# Altium project Esp32.PrjPcb
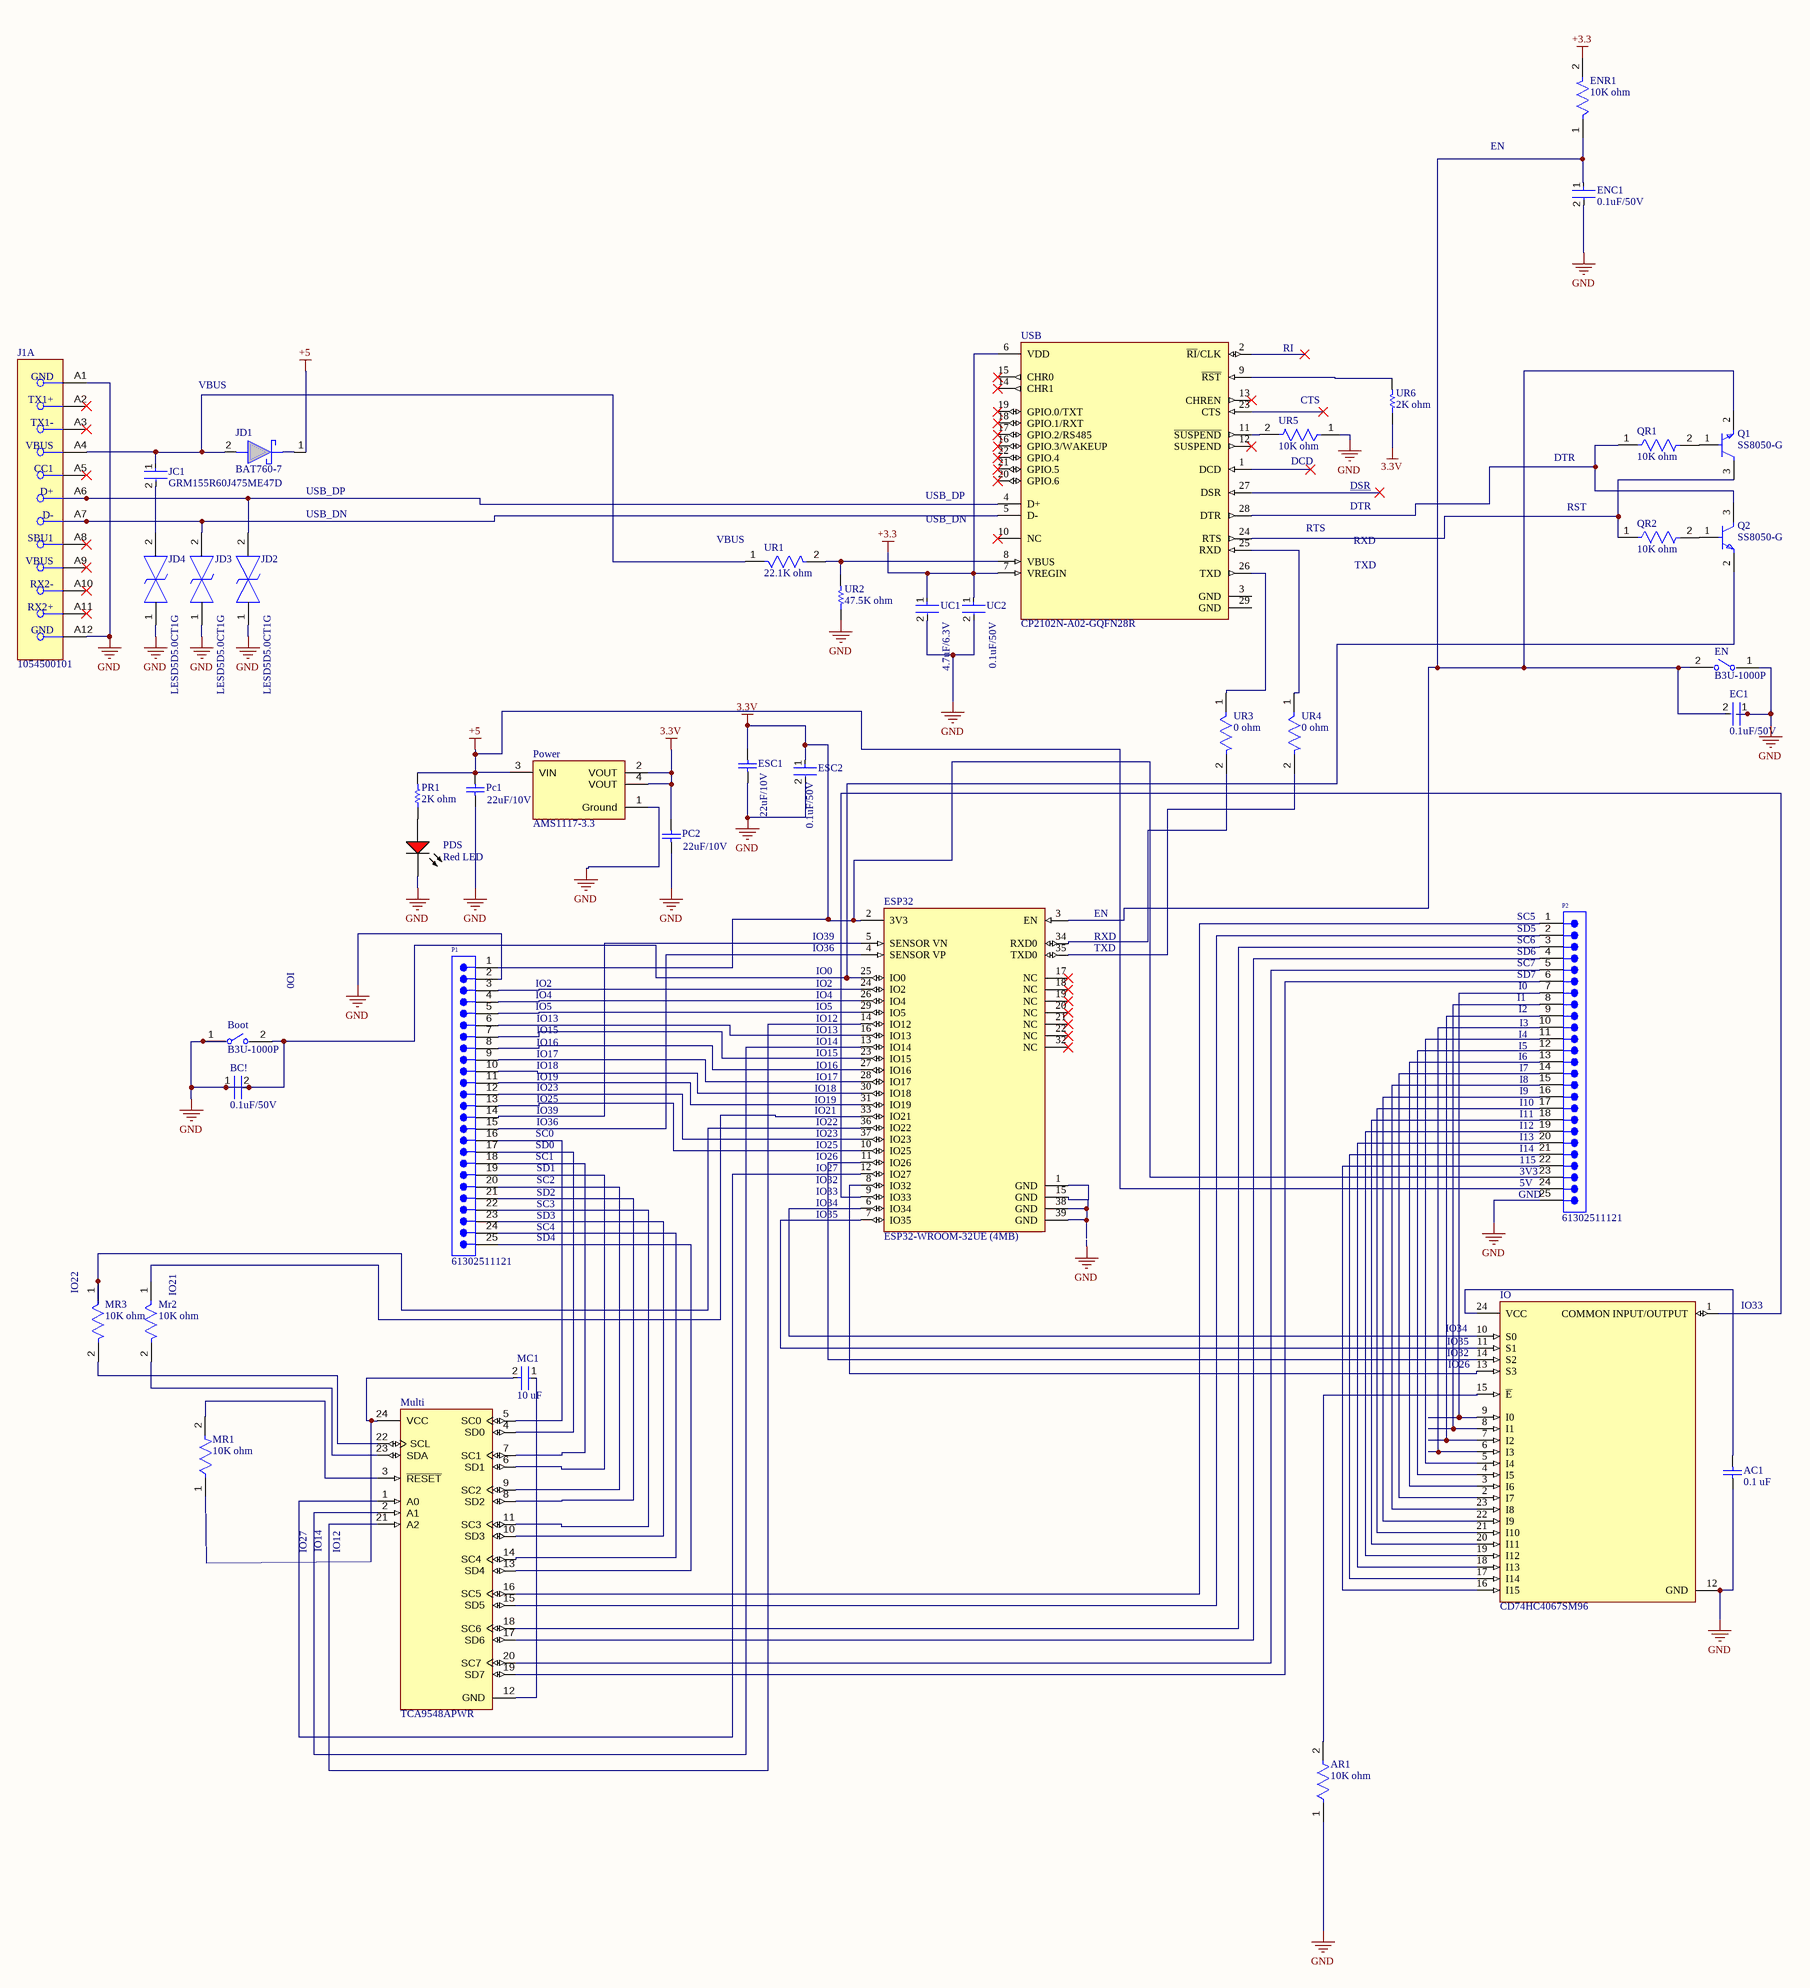
[diagram p0: Sheet1.SchDoc]
1 sheet, 43 parts. Net scope: global (net labels, ports and power ports of the same name join across sheets).
Board file: PCB1.PcbDoc

## Sheet Sheet1.SchDoc
size D; SheetNumber: 1; SheetTotal: 1

### Parts
AC1  0.1 uF  [CAPC1005X55X30LL05T10]
AR1  10K ohm  [FP-CRCW1206-e3-IPC_C]
BC!  0.1uF/50V  [FP-C0603-CJ-MFG]
Boot  B3U-1000P  [FP-B3U-1000P-MFG]
EC1  0.1uF/50V  [FP-C0603-CJ-MFG]
EN  B3U-1000P  [FP-B3U-1000P-MFG]
ENC1  0.1uF/50V  [FP-C0603-CJ-MFG]
ENR1  10K ohm  [FP-CRCW0402-e3-IPC_B]
ESC1  22uF/10V  [CAPC2013X95X45ML15T25]
ESC2  0.1uF/50V  [FP-C0603-CJ-MFG]
ESP32  ESP32-WROOM-32UE (4MB)  [FP-ESP32-WROOM-32UE_4MB-MFG]
IO  CD74HC4067SM96  [FP-DB0024A-IPC_C]
J1  1054500101  [FP-1054500101-MFG]  (part A of 3)
JC1  GRM155R60J475ME47D  [FP-GRM155-0_1-IPC_B]
JD1  BAT760-7  [SOD2513X120N]
JD2  LESD5D5.0CT1G  [SODFL1006X40N]
JD3  LESD5D5.0CT1G  [SODFL1006X40N]
JD4  LESD5D5.0CT1G  [SODFL1006X40N]
MC1  10 uF  [FP-C1608-080-0_1-MFG]
MR1  10K ohm  [FP-CRCW1206-e3-IPC_C]
Mr2  10K ohm  [FP-CRCW1206-e3-IPC_C]
MR3  10K ohm  [FP-CRCW1206-e3-IPC_C]
Multi  TCA9548APWR  [FP-PW0024A-MFG]
P1  61302511121  [61302511121]
P2  61302511121  [61302511121]
Pc1  22uF/10V  [CAPC2013X95X45ML15T25]
PC2  22uF/10V  [CAPC2013X95X45ML15T25]
PDS  Red LED  [VISH-TLMX1100_V]
Power  AMS1117-3.3  [FP-AMS1117-IPC_C]
PR1  2K ohm  [RESC3216X50X50LL20T25]
Q1  SS8050-G  [FP-SS8050-G-MFG]
Q2  SS8050-G  [FP-SS8050-G-MFG]
QR1  10K ohm  [FP-CRCW0402-e3-IPC_B]
QR2  10K ohm  [FP-CRCW0402-e3-IPC_B]
UC1  4.7uF/6.3V  [FP-GRM155-0_1-IPC_B]
UC2  0.1uF/50V  [FP-C0603-CJ-MFG]
UR1  22.1K ohm  [FP-RG3216-IPC_B]
UR2  47.5K ohm  [RESC2013X55X40NL15T20]
UR3  0 ohm  [FP-CRCW0402-e3-IPC_C]
UR4  0 ohm  [FP-CRCW0402-e3-IPC_C]
UR5  10K ohm  [FP-CRCW1206-e3-IPC_C]
UR6  2K ohm  [RESC3216X50X50LL20T25]
USB  CP2102N-A02-GQFN28R  [FP-CP2102N-A02-GQFN28R-MFG]

### Nets
3.3V: ESC1.2 ESC2.1 ESP32.2(3V3) P1.1 P2.23 PC2.2 Power.2(VOUT) Power.4(VOUT) UR6.1
+3.3: ENR1.2 UC1.1 UC2.1 USB.6(VDD) USB.7(VREGIN)
+5: JD1.1(K) P2.24 Pc1.2 Power.3(VIN) PR1.2
GND: AC1.1 AR1.1 BC!.1 BC!.2 Boot.1 Boot.2 EC1.1 EN.1 ENC1.2 ESC1.1 ESC2.2 ESP32.25(IO0) IO.12(GND) J1.A1(GND) J1.A12(GND) JD2.1 JD3.1 JD4.1 P1.2 P2.25 Pc1.1 PC2.1 PDS.2(K) Power.1(Ground) Q2.2(E) UC1.2 UC2.2 UR2.1 UR5.1
NetAC1_2: AC1.2 IO.24(VCC)
NetAR1_2: AR1.2 IO.15(~{E})
NetEC1_2: EC1.2 EN.2 ENC1.1 ENR1.1 ESP32.3(EN) Q1.2(E)
NetESP32_1: ESP32.1(GND) ESP32.15(GND)
NetESP32_4: ESP32.4(SENSOR_VP) P1.15
NetESP32_5: ESP32.5(SENSOR_VN) P1.14
NetESP32_6: ESP32.6(IO34) IO.10(S0)
NetESP32_7: ESP32.7(IO35) IO.11(S1)
NetESP32_8: ESP32.8(IO32) IO.13(S3)
NetESP32_9: ESP32.9(IO33) IO.1(COMMON_INPUT/OUTPUT)
NetESP32_10: ESP32.10(IO25) P1.13
NetESP32_11: ESP32.11(IO26) IO.14(S2)
NetESP32_12: ESP32.12(IO27) Multi.1(A0)
NetESP32_13: ESP32.13(IO14) Multi.2(A1)
NetESP32_14: ESP32.14(IO12) Multi.21(A2)
NetESP32_16: ESP32.16(IO13) P1.6
NetESP32_23: ESP32.23(IO15) P1.7
NetESP32_24: ESP32.24(IO2) P1.3
NetESP32_26: ESP32.26(IO4) P1.4
NetESP32_27: ESP32.27(IO16) P1.8
NetESP32_28: ESP32.28(IO17) P1.9
NetESP32_29: ESP32.29(IO5) P1.5
NetESP32_30: ESP32.30(IO18) P1.10
NetESP32_31: ESP32.31(IO19) P1.11
NetESP32_33: ESP32.33(IO21) Mr2.1
NetESP32_34: ESP32.34(RXD0) UR3.2
NetESP32_35: ESP32.35(TXD0) UR4.2
NetESP32_36: ESP32.36(IO22) MR3.1
NetESP32_37: ESP32.37(IO23) P1.12
NetESP32_38: ESP32.38(GND) ESP32.39(GND)
NetIO_2: IO.2(I7) P2.14
NetIO_3: IO.3(I6) P2.13
NetIO_4: IO.4(I5) P2.12
NetIO_5: IO.5(I4) P2.11
NetIO_6: IO.6(I3) P2.10
NetIO_7: IO.7(I2) P2.9
NetIO_8: IO.8(I1) P2.8
NetIO_9: IO.9(I0) P2.7
NetIO_16: IO.16(I15) P2.22
NetIO_17: IO.17(I14) P2.21
NetIO_18: IO.18(I13) P2.20
NetIO_19: IO.19(I12) P2.19
NetIO_20: IO.20(I11) P2.18
NetIO_21: IO.21(I10) P2.17
NetIO_22: IO.22(I9) P2.16
NetIO_23: IO.23(I8) P2.15
NetJ1_A4: J1.A4(VBUS) JC1.1 JD1.2(A) UR1.1
NetJ1_A6: J1.A6(D+) JD2.2 USB.4(D+)
NetJ1_A7: J1.A7(D-) JD3.2 USB.5(D-)
NetJC1_2: JC1.2 JD4.2
NetMC1_1: MC1.1 Multi.12(GND)
NetMC1_2: MC1.2 MR1.1 Multi.24(VCC)
NetMR1_2: MR1.2 Multi.3(~{RESET})
NetMr2_2: Mr2.2 Multi.23(SDA)
NetMR3_2: MR3.2 Multi.22(SCL)
NetMulti_4: Multi.4(SD0) P1.17
NetMulti_5: Multi.5(SC0) P1.16
NetMulti_6: Multi.6(SD1) P1.19
NetMulti_7: Multi.7(SC1) P1.18
NetMulti_8: Multi.8(SD2) P1.21
NetMulti_9: Multi.9(SC2) P1.20
NetMulti_10: Multi.10(SD3) P1.23
NetMulti_11: Multi.11(SC3) P1.22
NetMulti_13: Multi.13(SD4) P1.25
NetMulti_14: Multi.14(SC4) P1.24
NetMulti_15: Multi.15(SD5) P2.2
NetMulti_16: Multi.16(SC5) P2.1
NetMulti_17: Multi.17(SD6) P2.4
NetMulti_18: Multi.18(SC6) P2.3
NetMulti_19: Multi.19(SD7) P2.6
NetMulti_20: Multi.20(SC7) P2.5
NetPDS_1: PDS.1(A) PR1.1
NetQ1_1: Q1.1(B) QR1.2
NetQ1_3: Q1.3(C) QR2.1 USB.24(RTS)
NetQ2_1: Q2.1(B) QR2.2
NetQ2_3: Q2.3(C) QR1.1 USB.28(DTR)
NetUR1_2: UR1.2 UR2.2 USB.8(VBUS)
NetUR3_1: UR3.1 USB.26(TXD)
NetUR4_1: UR4.1 USB.25(RXD)
NetUR5_2: UR5.2 USB.11(~{SUSPEND})
NetUR6_2: UR6.2 USB.9(~{RST})

Not connected (* = marked no-connect by the designer): ESP32 17(NC)* 18(NC)* 19(NC)* 20(NC)* 21(NC)* 22(NC)* 32(NC)*; J1 A2(TX1+)* A3(TX1-)* A5(CC1)* A8(SBU1)* A9(VBUS)* A10(RX2-)* A11(RX2+)*; USB 1(DCD)* 2(~{RI}/CLK)* 3(GND) 10(NC)* 12(SUSPEND)* 13(CHREN)* 14(CHR1)* 15(CHR0)* 16(GPIO.3/WAKEUP)* 17(GPIO.2/RS485)* 18(GPIO.1/RXT)* 19(GPIO.0/TXT)* 20(GPIO.6)* 21(GPIO.5)* 22(GPIO.4)* 23(CTS)* 27(DSR)* 29(GND)

### Notes on the sheet
- EN
- VBUS
- RI
- (near UR5) CTS
- (near UR5) DCD
- DTR
- (near JD1) USB_DP
- USB_DN
- USB_DP
- DSR <TXD>
- RST
- (near UR1) VBUS
- RTS
- RXD
- TXD
- (near ESP32) EN
- SC5
- IO0
- IO39
- IO36
- (near ESP32) RXD
- (near ESP32) TXD
- SD5
- SC6
- SD6
- SC7
- SD7
- (near P1) IO2
- (near P1) IO4
- (near P1) IO5
- (near P1) IO13
- (near P1) IO15
- IO2
- IO4
- IO5
- IO12
- IO13
- I1
- (near P2) I2
- (near P2) I4
- (near P2) I0
- (near P2) I3
- (near P1) IO16
- (near P1) IO17
- (near P1) IO18
- (near P1) IO19
- (near P1) IO23
- IO18
- IO14
- IO15
- IO16
- IO17
- (near P2) I5
- (near P2) I6
- (near P2) I7
- (near P2) I8
- (near P2) I9
- (near P1) SC0
- (near P1) SD0
- (near P1) IO25
- (near P1) IO39
- (near P1) IO36
- IO19
- IO21
- IO22
- IO23
- IO25
- (near P2) I10
- (near P2) I11
- (near P2) I12
- (near P2) I13
- (near P2) I14
- (near P1) SC1
- (near P1) SD1
- (near P1) SC2
- (near P1) SD2
- (near P1) SC3
- IO26
- IO27
- IO32
- IO33
- IO34
- (near P2) GND
- (near P2) 115
- (near P2) 3V3
- (near P2) 5V
- (near P1) SD3
- (near P1) SC4
- (near P1) SD4
- IO35
- (near MR3) IO22
- (near Mr2) IO21
- (near IO) IO33
- (near IO) IO34
- (near IO) IO35
- (near IO) IO32
- (near IO) IO26

### Library data of the parts
AC1 = CMP-0001-00074-2: Manufacturer: Kemet; Part Number: C0402C104K4RACTU
AR1 MR1 Mr2 MR3 UR5 = CMP-2003-04807-2: RES Thick Film, 10kΩ, 1%, 0.25W, 100ppm/°C, 1206; Working Voltage: 200V; Max Power Dissipation: 250mW; Resistance: 10kR; Tolerance: 1%; Width: 0.063inch; Height: 0.55mm; Number of Pins: 2; Voltage Rating: 200V; Temperature Coefficient: 100ppm/°C; Military Standard: Not; Features: Automotive AEC-Q200; Depth: 1.6mm; Radiation Hardening: No; Termination: SMD/SMT; Case Code (Imperial): 1206; Weight: 0.000353oz; Length: 3.2mm; Package Quantity: 10; Voltage Rating (DC): 200V; Case/Package: 1206; Min Operating Temperature: -55°C; Number of Terminations: 2; Composition: Thick Film; Contact Plating: Tin; Power Rating: 250mW; Packaging: Tape and Reel; Max Operating Temperature: 155°C; Lead Free: Lead Free; Case Code (Metric): 3216
BC! EC1 ENC1 ESC2 UC2 = CMP-2006-03300-2: CAP CER 0.1UF 50V X7R 0603; Manufacturer Part Number: C0603X104K5RACTU; Manufacturer: Kemet; Capacitance: 100nF; Tolerance: 10%; Value: 100nF; Temperature Coefficient: 15%; Temperature Range High: +125°C; Temperature Range Low: -55°C; Voltage: 50V; ComponentLink2Description: Datasheet; RoHS: TRUE; ComponentLink2URL: https://content.kemet.com/datasheets/KEM_C1013_X7R_FT-CAP_SMD.pdf; Material: Ceramic; Device Class L3: Ceramic Capacitors; Device Class L2: Capacitors; Package: C0603-CJ; Height: 0.95mm; Device Class L1: Passive Components; Temperature Characteristic: X7R; Lead Free: Yes; Digikey Description: CAP CER 0.1UF 50V X7R 0603; Automotive: No; Mouser Description: Capacitor; Ceramic; Cap 0.1uF; Tol+10%; SMT; Flexible Termination; Vol-Rtg 50V; TR; Temperature: -55°C to +125°C; Octopart: https://octopart.com/c0603x104k5ractu-kemet-9145062; Category: Cap; Voltage Rating: 50V; Ipc Land Pattern Name: CAPC16080X80
Boot EN = CMP-2100-03586-2: SWITCH TACTILE SPST-NO 0.05A 12V; Contact Resistance: 100mR; Operating Force: 1.5N; Max Current Rating: 50mA; Switch Travel: 0.15mm; Actuator Type: Standard; Mechanical Life: 200000Cycles; Ratings: Dust Proof; Illumination Type: Non-Illuminated; Throw Configuration: SPST; Actuator Length: 0.4mm; Switch Function: Off-Mom; Height: 1.2mm; Width: 3mm; Weight: 0.000776oz; Contact Material: Silver; Max Voltage Rating (DC): 12V; Insulation Resistance: 100MR; Lead Free: Lead Free; Current Rating: 50mA; Termination: SMD/SMT; Length: 4mm; Voltage Rating (DC): 12V; Contact Current Rating: 50mA; Orientation: Straight; Depth: 2.5mm; Max Operating Temperature: 70°C; Packaging: Tape and Reel; Min Operating Temperature: -25°C; Package Quantity: 1; Mount: Surface Mount; Electrical Life: 200000Cycles
ENR1 QR1 QR2 = CMP-2002-08135-2: RES SMD 10K OHM 1% 1/16W 0402; Power Rating: 63mW; Resistance: 10kR; Voltage Rating: 50V; Temperature Coefficient: 100ppm/°C; Case Code (Metric): 1005; Features: Automotive AEC-Q200; Termination: SMD/SMT; Mount: Surface Mount; Package Quantity: 10; Packaging: Tape and Reel; Case Code (Imperial): 0402; Weight: 2.3E-05oz; Lead Free: Lead Free; Width: 0.02inch; Max Power Dissipation: 63mW; Tolerance: 1%; Number of Terminations: 2; Height: 0.35mm; Number of Pins: 2; Composition: Thick Film; Length: 1mm; Voltage Rating (DC): 50V; Case/Package: 0402; Radiation Hardening: No; Contact Plating: Tin; Depth: 0.5mm; Military Standard: Not; Min Operating Temperature: -55°C; Max Operating Temperature: 155°C
ESC1 Pc1 PC2 = CMP-2007-00096-1: Manufacturer: Murata; Part Number: GRM219R61A226MEA0D
ESP32 = CMP-194065-000015-1: RX TXRX MODULE WIFI U.FL SMD
IO = CMP-04892-000038-1: IC MUX/DEMUX 1X16 24SSOP; Supply Type: Single; High Level Output Current: 25mA; Min Supply Voltage: 2V; Number of Circuits: 16; Max Supply Voltage: 6V; Number of Channels: 1; Turn-On Delay Time: 300ns; Max Supply Current: 8uA; Bandwidth: 89MHz; Turn-Off Delay Time: 290ns; Propagation Delay: 75ns; Logic Function: Multiplexer; On-State Resistance: 160R; Polarity: Non-Inverting; Width: 5.3mm; Case/Package: SSOP; Max Operating Temperature: 125°C; Mount: Surface Mount; Min Operating Temperature: -55°C; REACH SVHC: No SVHC; Contact Plating: Gold; Max Output Current: 25mA; Weight: 0.006081oz; Height: 1.95mm; Package Quantity: 2000; Length: 8.2mm; Lead Free: Lead Free; Operating Supply Current: 8uA; Packaging: Tape and Reel; Series: 74HC; Low Level Output Current: 25mA; Number of Outputs: 1; Termination: SMD/SMT; Number of Inputs: 16; Number of Bits: 16; Radiation Hardening: No; Number of Pins: 24
J1 = CMP-04767-000004-1: CONN RCP USB3.1 TYPEC 24P SMD RA; Manufacturer: Molex; Number Of Contacts: 24; Voltage Rating: 30V; Shielding: true; Is Female: yes; Current Rating: 0.25/1.25/5A; Pitch: 0.5mm; Conn Orientation: Right Angle; Package: 0; Height: 3.44mm; Footprint Url: https://www.molex.com/pdm_docs/sd/1054500101_sd.pdf; Device Class L1: Connectors; Category: Conn; Device Class L2: USB Connectors; Digikey Description: CONN RCP USB3.1 TYPEC 24P SMD RA; Contact Material: Gold,Nickel; Mouser Description: USB Shielded I/O Receptacle; Type C; Right Angle; Surface Mount; Gold over Nickel; ComponentLink2Description: Datasheet; Lead Free: Yes; Automotive: No; Temperature Range High: +85°C; RoHS: TRUE; Octopart: https://octopart.com/105450-0101-molex-68082325; ComponentLink2URL: https://www.molex.com/webdocs/datasheets/pdf/en-us/1054500101_IO_CONNECTORS.pdf; Temperature: -30°C to +85°C; Usb Standard: USB 3.1; Temperature Range Low: -30°C; Device Class L3: unset; Manufacturer Part Number: 1054500101
JC1 UC1 = CMP-2008-04549-2: Chip Multilayer Ceramic Capacitors for General Purpose, 0402, 4.7uF, X5R, 15%, 20%, 6.3V; Height: 0.5mm; Weight: 0.000212oz; Length: 1mm; Case Code (Metric): 1005; Packaging: Tape and Reel; Termination: SMD/SMT; Dielectric: X5R; Depth: 0.5mm; Case Code (Imperial): 0402; Min Operating Temperature: -55°C; Case/Package: 0402; Voltage: 6.3V; Width: 0.02inch; Capacitance: 4.7uF; Lead Free: Lead Free; Thickness: 0.022inch; Contact Plating: Tin; REACH SVHC: No SVHC; Package Quantity: 10000; Tolerance: 20%; Voltage Rating (DC): 6.3V; Voltage Rating: 6.3V; Mount: Surface Mount; Max Operating Temperature: 85°C
JD1 = BAT760-7: Diode Schottky 30V 1A 2Pin SOD323 Diodes Inc BAT760-7, SMT Schottky Diode, 30V 1A, 2-Pin SOD-323; Manufacturer_Name: Diodes Incorporated; Geometry.Height: 1.2mm; Mouser Part Number: 621-BAT760-7; Mouser Price/Stock: https://www.mouser.co.uk/ProductDetail/Diodes-Incorporated/BAT760-7?qs=JV7lzlMm3yKDDyO09xoRbQ%3D%3D; Manufacturer_Part_Number: BAT760-7; Datasheet Link: https://www.diodes.com/assets/Datasheets/ds30498.pdf
JD2-JD4 = CPDQ5V0-HF: ESD Suppressors / TVS Diodes SMD ESD Diode 5V Bi-Direction; Manufacturer_Name: Comchip Technology; Geometry.Height: 0.4mm; Mouser Part Number: 750-CPDQ5V0-HF; Mouser Price/Stock: https://www.mouser.co.uk/ProductDetail/Comchip-Technology/CPDQ5V0-HF?qs=ccyN4P6STah119k8k5VB0Q%3D%3D; Manufacturer_Part_Number: CPDQ5V0-HF; Datasheet Link: https://datasheet.datasheetarchive.com/originals/distributors/Datasheets-DGA26/1842344.pdf
MC1 = CMP-2000-04979-3: Multilayer Ceramic Capacitors 10μF ±10% 10V X5R SMD 0603; Capacitance: 10uF; Dielectric Material: Ceramic; Construction: Flat; Height: 0.8mm; Thickness: 0.035inch; Case Code (Metric): 1608; Radiation Hardening: No; Number of Pins: 2; Voltage Rating (DC): 10V; Depth: 0.8mm; Voltage: 10V; RoHS Compliant: Yes; Voltage Rating: 10V; Package Quantity: 1; Resistor Type: Ceramic; Termination: SMD/SMT; Lead Free: Lead Free; REACH SVHC: No SVHC; Tolerance: 10%; Mount: Surface Mount; Series: C; Packaging: Tape and Reel; Width: 0.8mm; Dielectric: X5R; Weight: 7.1E-05oz; Length: 1.6mm; Max Operating Temperature: 85°C; Case Code (Imperial): 0603; Case/Package: 0603; Min Operating Temperature: -55°C
Multi = CMP-04892-000002-1: IC I2C SW 8CH W/RESET 24TSSOP; Manufacturer: Texas Instruments; Number Of Circuits: 1; Mux Demux Ratio: 1:8; Nominal Supply Current: 2-50uA; Interface: I2C,SMBus; Min Supply Voltage: 1.65V; Standoff Height: 0.05mm; Max Supply Voltage: 5.5V; Device Class L2: Interface ICs; ComponentLink2Description: Datasheet; Ipc Land Pattern Name: SOP65P640X120-24; Category: IC; Device Class L1: Integrated Circuits (ICs); Manufacturer Part Number: TCA9548APWR; RoHS: TRUE; Temperature Range High: +85°C; Digikey Description: IC I2C SW 8CH W/RESET 24TSSOP; Temperature Range Low: -40°C; Lead Free: Yes; Package: PW0024A; ComponentLink2URL: http://www.ti.com/lit/ds/symlink/tca9548a.pdf; Device Class L3: Multiplexers; Ambient Temperature Range Low: -40°C; Mouser Description: Low-Voltage 8-Channel I2C Switch With Reset 24-TSSOP -40 to 85; Temperature: -40°C to +85°C; Octopart: https://octopart.com/tca9548apwr-texas+instruments-22266789; Ambient Temperature Range High: +85°C; Automotive: No; Height: 1.2mm
P1 P2 = CMP-1502-01112-2: NexarPartId: 32855564; Pitch: 2.54mm; Gender: Male; Operating Supply Voltage: 250V; Current Rating: 3A; Contact Resistance: 20mΩ; Number of Positions: 25; Connector Type: Male Pin; Packaging: Bulk; Lead Pitch: 2.54mm; Orientation: Vertical; Color: Black; Contact Mating Length: 5.9944mm; Contact Material: Copper; Number of Contacts: 25; REACH SVHC: Unknown; RoHS: Compliant; Number of Pins: 25; Contact Plating: Gold; Termination: Solder; Number of Rows: 1; Mount: Through Hole
PDS = CMP-1666-00027-1: LED, RED, 2.1 V, -40 to 100 degC, 2-Pin SMD (0603), RoHS, Tape and Reel; Type (Capacitors): C0G; Resistance: 100000000000 Ohm; Capacitance: 12 pF; Voltage Rating: 50 V; Tolerance: 5%; Min Operating Temperature: -55degC; REACH SVHC: No SVHC; ComponentLink2Description: Datasheet; ComponentLink1URL: http://www.vishay.com/; Width: 0.8 mm; Package Quantity: 4000; PackageReference: TLMX1100; ComponentLink2URL: http://www.vishay.com/docs/83173/tlmb1100.pdf; Case/Package: 0603; Case Code (Metric): 1608; Packaging: Tape and Reel; Pins: 2; ComponentLink1Description: Manufacturer URL; Max Operating Temperature: 125degC; Height: 0.8 mm; Length: 1.6 mm; Mount: Surface Mount; PackageDescription: 2-Pin Surface Mount Device, Body 1.6 x 0.8 mm; DatasheetVersion: Rev. 2.7, 03/2016; Case Code (Imperial): 0603; Voltage Rating (DC): 50 V; RoHSCompliant: True; Radiation Hardening: No
Power = CMP-209535-000001-1: LDO Voltage Regulators 1A, 3.3V; Manufacturer: Advanced Monolithic Systems; Dropout Voltage: 1.1V; Output Type: Fixed; Nominal Supply Current: 5mA; Max Power Dissipation: 1.2W; Max Supply Voltage: 15V; Number Of Outputs: 1; Standoff Height: 0.64mm; Max Junction Temp: +125°C; Height: 1.8mm; Package: AMS1117; Device Class L2: Power Management ICs; ComponentLink2Description: Datasheet; ComponentLink2URL: http://www.advanced-monolithic.com/pdf/ds1117.pdf; Category: IC; RoHS: TRUE; Automotive: No; Device Class L1: Integrated Circuits (ICs); Output Current: 1A; Device Class L3: Voltage Regulators - Linear; Temperature: -40°C to +125°C; Output Voltage: 3.3V; Manufacturer Part Number: AMS1117-3.3; Temperature Range Low: -40°C; Octopart: https://octopart.com/ams1117-3.3-advanced+monolithic+systems-25899300; Lead Free: Yes; Ipc Land Pattern Name: SOT229P700X180-4; Temperature Range High: +125°C
PR1 UR6 = CMP-2003-02566-1: Part Number: RG3216P-2001-B-T1; Manufacturer: Susumu
Q1 Q2 = CMP-20235-000001-1: NPN TRANSISTOR 1.5A 40V SOT-23 R; Transition Frequency: 100MHz; Max Breakdown Voltage: 25V; Collector Emitter Voltage (VCEO): 400mV; Max Power Dissipation: 300mW; Max Collector Current: 1.5A; Case/Package: TO-236-3; Packaging: Tape and Reel; RoHS Compliant: Yes; Mount: Surface Mount; Collector Emitter Breakdown Voltage: 25V
UR1 = CMP-28537-004057-1: Automotive Metal Thin Film Chip Resistor, 1206, 22.1kΩ, 0.25%, 5ppm/°C, 0.25W, 200V; Max Power Dissipation: 250mW; Power Rating: 125mW; Resistance: 22.1kR; Voltage Rating: 150V; Length: 3.2mm; RoHS Compliant: Yes; Case/Package: 1206; Packaging: Tape and Reel; Temperature Coefficient: 5ppm/°C; Tolerance: 0.25%; Voltage Rating (DC): 200V; Case Code (Metric): 3216; Width: 1.6mm; Number of Terminations: 2; Case Code (Imperial): 1206; Height: 400um; Termination: SMD/SMT; Series: RG; Features: Automotive AEC-Q200; Lead Free: Lead Free; Min Operating Temperature: -55°C; Max Operating Temperature: 155°C
UR2 = CMP-2001-04773-1: Part Number: TNPW080547K5BEEN; Manufacturer: Vishay Dale
UR3 UR4 = CMP-2002-08122-2: RES Thick Film, 0Ω, 0.063W, 0402; Tolerance: 5%; Max Power Dissipation: 63mW; Voltage Rating: 50V; Temperature Coefficient: 100ppm/°C; Resistance: 0mR; Contact Plating: Tin; Height: 0.35mm; Radiation Hardening: No; Features: Automotive AEC-Q200; Composition: Thick Film; Width: 0.5mm; Weight: 2.3E-05oz; Termination: SMD/SMT; Packaging: Tape and Reel; Mount: Surface Mount; Case Code (Metric): 1005; Military Standard: Not; Min Operating Temperature: -55°C; Number of Terminations: 2; Package Quantity: 1; Case Code (Imperial): 0402; Depth: 0.5mm; Max Operating Temperature: 155°C; Case/Package: 0402; Power Rating: 63mW; Lead Free: Lead Free; Voltage Rating (DC): 50V; Length: 1mm
USB = CMP-08093-000007-1: IC USB TO UART BRIDGE QFN28